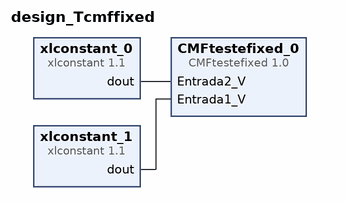
[diagram p0: block diagram of the top level]
# Vivado block design design_Tcmffixed, xc7z020clg484-1, Vivado 2018.3
create_bd_design design_Tcmffixed

create_bd_cell -type ip -vlnv xilinx.com:user:CMFtestefixed:1.0 CMFtestefixed_0
create_bd_cell -type ip -vlnv xilinx.com:ip:xlconstant:1.1 xlconstant_0
set_property -dict {CONFIG.CONST_VAL 2 CONFIG.CONST_WIDTH 18} [get_bd_cells xlconstant_0]
create_bd_cell -type ip -vlnv xilinx.com:ip:xlconstant:1.1 xlconstant_1
set_property -dict {CONFIG.CONST_VAL 3 CONFIG.CONST_WIDTH 18} [get_bd_cells xlconstant_1]

# ---- connections ----

connect_bd_net [get_bd_pins xlconstant_0/dout] [get_bd_pins CMFtestefixed_0/Entrada2_V]
connect_bd_net [get_bd_pins xlconstant_1/dout] [get_bd_pins CMFtestefixed_0/Entrada1_V]

validate_bd_design
save_bd_design
